# EAGLE design pmon_uno (EAGLE 6.5.0)
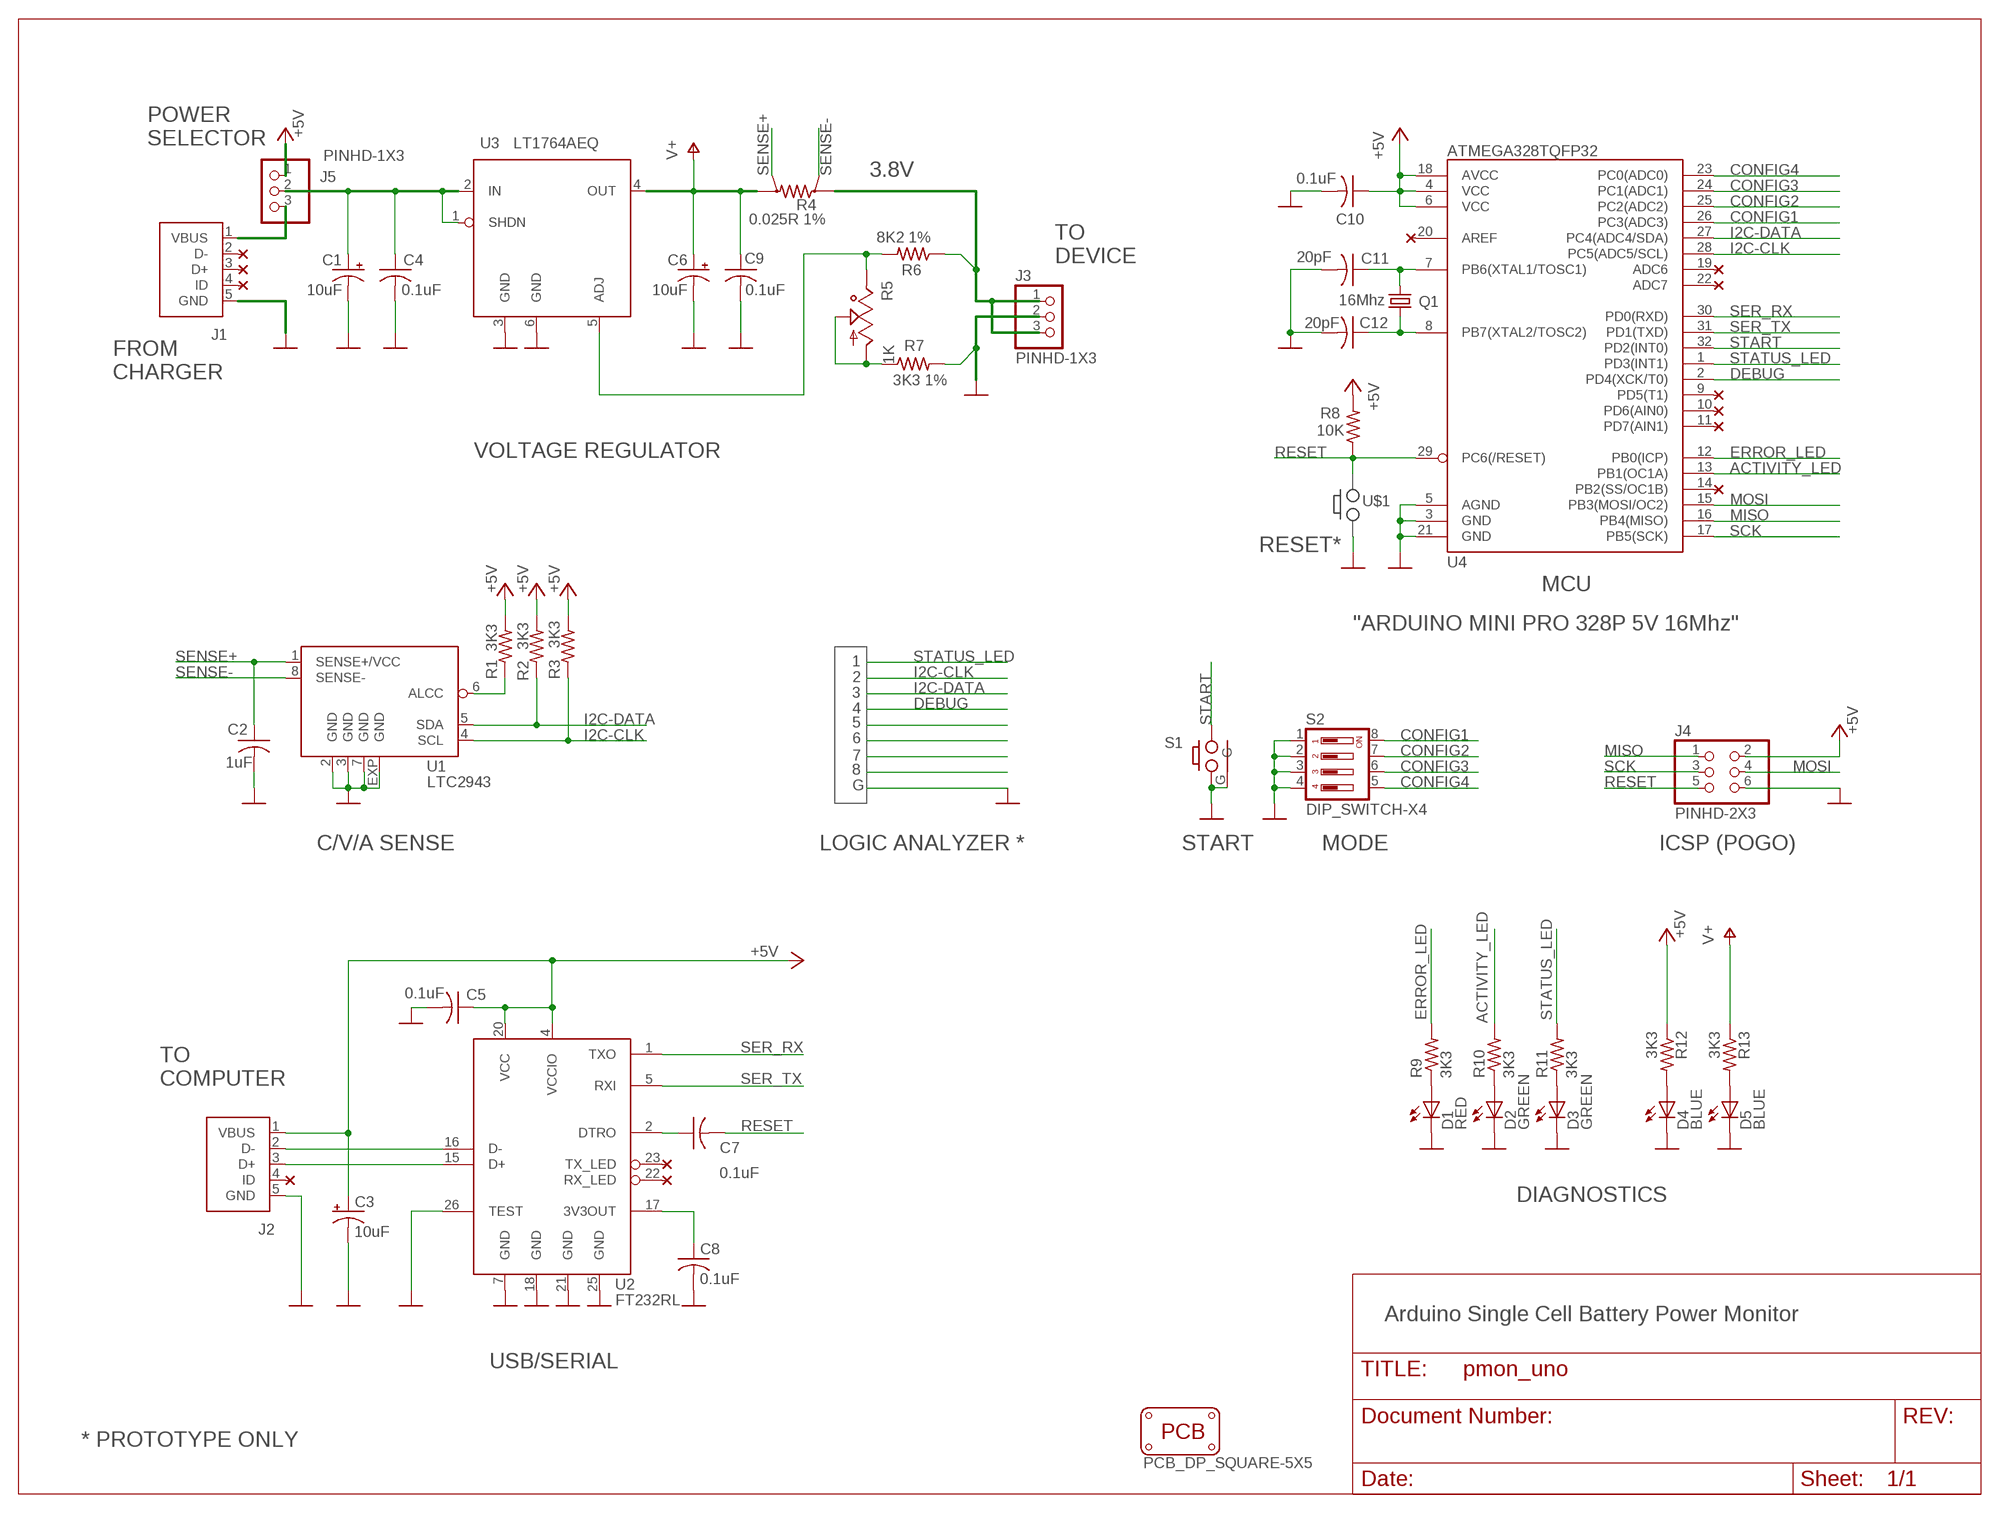
[diagram p0: schematic, sheet 1]

## Parts
C1  10uF  CPOL-USA/3216-18R  [A/3216-18R]
C2  1uF  CAP-C0603  [C0603]
C3  10uF  CPOL-USA/3216-18R  [A/3216-18R]
C4  0.1uF  CAP-C0603  [C0603]
C5  0.1uF  CAP-C0603  [C0603]
C6  10uF  CPOL-USA/3216-18R  [A/3216-18R]
C7  0.1uF  CAP-C0603  [C0603]
C8  0.1uF  CAP-C0603  [C0603]
C9  0.1uF  CAP-C0603  [C0603]
C10  0.1uF  CAP-C0603  [C0603]
C11  20pF  CAP-C0603  [C0603]
C12  20pF  CAP-C0603  [C0603]
D1  RED  LED1206  [1206-LED]
D2  GREEN  LED1206  [1206-LED]
D3  GREEN  LED1206  [1206-LED]
D4  BLUE  LED1206  [1206-LED]
D5  BLUE  LED1206  [1206-LED]
J1  USB  [USB-MICRO-ZX62RD-AB-5P8]
J2  USB  [USB-MICRO-ZX62RD-AB-5P8]
J3  PINHD-1X3  [1X03]
J4  PINHD-2X3  [2X03]
J5  PINHD-1X3  [1X03]
PCB1  PCB_DP_SQUARE-5X5  [DP5050_V1]
Q1  16Mhz  CRYSTALCTS406  [CRYSTAL-CTS406]
R1  3K3  RES-R0603  [R0603]
R2  3K3  RES-R0603  [R0603]
R3  3K3  RES-R0603  [R0603]
R4  0.025R 1%  RES-SHUNT-6432  [KELVIN-6432]
R5  1K  TRIM_US-SM-42/43A  [TRIM-POT_SM-42/43A]
R6  8K2 1%  RES-R0603  [R0603]
R7  3K3 1%  RES-R0603  [R0603]
R8  10K  RES-R0603  [R0603]
R9  3K3  RES-R0603  [R0603]
R10  3K3  RES-R0603  [R0603]
R11  3K3  RES-R0603  [R0603]
R12  3K3  RES-R0603  [R0603]
R13  3K3  RES-R0603  [R0603]
S1  PUSH_BUTTON_SHIELDED  [TLE1105]
S2  DIP_SWITCH-X4  [DIP-SWITCH-X4]
U1  LTC2943  [DFN8-3X3]
U2  FT232RL  [SSOP28DB]
U3  LT1764AEQ  LTE1764  [TO263-5]
U4  ATMEGA328TQFP32  [TQFP32-08]

## Nets
+5V: C3.+ C5.1 C10.1 J2.1(VBUS) J4.2 J5.1 R1.2 R2.2 R3.2 R8.2 R12.1 U2.4(VCCIO) U2.20(VCC) U4.4(VCC) U4.6(VCC) U4.18(AVCC)
ACTIVITY_LED: R10.2 U4.13(PB1(OC1A))
CONFIG1: S2.8 U4.26(PC3(ADC3))
CONFIG2: S2.7 U4.25(PC2(ADC2))
CONFIG3: S2.6 U4.24(PC1(ADC1))
CONFIG4: S2.5 U4.23(PC0(ADC0))
DEBUG: U4.2(PD4(XCK/T0))
ERROR_LED: R9.2 U4.12(PB0(ICP))
GND: C1.- C2.2 C3.- C4.2 C5.2 C6.- C8.2 C9.2 C10.2 C11.2 C12.2 D1.C D2.C D3.C D4.C D5.C J1.5(GND) J2.5(GND) J3.2 J4.6 R7.2 S1.A S1.G S2.1 S2.2 S2.3 S2.4 U1.2(GND) U1.3(GND) U1.7(GND) U1.EXP(GND) U2.7(GND) U2.18(GND) U2.21(GND) U2.25(GND) U2.26(TEST) U3.3(GND) U3.6(GND) U4.3(GND) U4.5(AGND) U4.21(GND)
I2C-CLK: R3.1 U1.4(SCL) U4.28(PC5(ADC5/SCL))
I2C-DATA: R2.1 U1.5(SDA) U4.27(PC4(ADC4/SDA))
MISO: J4.1 U4.16(PB4(MISO))
MOSI: J4.4 U4.15(PB3(MOSI/OC2))
N$1: R1.1 U1.6(ALCC)
N$2: C11.1 Q1.1 U4.7(PB6(XTAL1/TOSC1))
N$3: D2.A R10.1
N$4: D1.A R9.1
N$5: J1.1(VBUS) J5.3
N$7: C12.1 Q1.3 U4.8(PB7(XTAL2/TOSC2))
N$9: C1.+ C4.1 J5.2 U3.1(SHDN) U3.2(IN)
N$10: J2.3(D+) U2.15(D+)
N$11: C7.1 U2.2(DTRO)
N$14: D5.A R13.2
N$15: J2.2(D-) U2.16(D-)
N$16: C8.1 U2.17(3V3OUT)
N$17: D4.A R12.2
N$18: R5.1 R5.2 R7.1
N$19: R5.3 R6.2 U3.5(ADJ)
N$20: D3.A R11.1
N$22: J3.1 J3.3 R4.I1 R6.1
RESET: C7.2 J4.5 R8.1 U4.29(PC6(/RESET))
SCK: J4.3 U4.17(PB5(SCK))
SENSE+: C2.1 R4.V2 U1.1(SENSE+/VCC)
SENSE-: R4.V1 U1.8(SENSE-)
SER_RX: U2.1(TXO) U4.30(PD0(RXD))
SER_TX: U2.5(RXI) U4.31(PD1(TXD))
START: S1.B U4.32(PD2(INT0))
STATUS_LED: R11.2 U4.1(PD3(INT1))
V+: C6.+ C9.1 R4.I2 R13.1 U3.4(OUT)
Unconnected: J1.2(D-) J1.3(D+) J1.4(ID) J2.4(ID) U2.22(RX_LED) U2.23(TX_LED) U4.9(PD5(T1)) U4.10(PD6(AIN0)) U4.11(PD7(AIN1)) U4.14(PB2(SS/OC1B)) U4.19(ADC6) U4.20(AREF) U4.22(ADC7)

## Notes on the sheet
- POWER
  SELECTOR
- 3.8V
- TO
  DEVICE
- FROM
  CHARGER
- VOLTAGE REGULATOR
- RESET*
- MCU
- "ARDUINO MINI PRO 328P 5V 16Mhz"
- 1
- 2
- 3
- 4
- 5
- 6
- 7
- 8
- G
- C/V/A SENSE | LOGIC ANALYZER * | START | MODE | ICSP (POGO)
- TO
  COMPUTER
- DIAGNOSTICS
- Arduino Single Cell Battery Power Monitor
- USB/SERIAL
- * PROTOTYPE ONLY

## Library data of the parts
C1 C3 C6 = pmon_uno:CPOL-US
C2 C4 C5 C7-C12 = pmon_uno:CAP-: CAPACITOR, American symbol
D1-D5 = pmon_uno:LED
J1 J2 = pmon_uno:USB
J3 J5 = pmon_uno:PINHD-1X3: PIN HEADER
J4 = pmon_uno:PINHD-2X3
PCB1 = pmon_uno:PCB_DP_SQUARE: Dangerous Prototypes Standard Square PCB sizes
Q1 = pmon_uno:CRYSTAL: CRYSTAL; OC_FARNELL: unknown; OC_NEWARK: unknown
R1-R3 R6-R13 = pmon_uno:RES-: RESISTOR, American symbol
R4 = pmon_uno:RES-SHUNT-: SMD SHUNT RESISTOR
R5 = pmon_uno:TRIM_US-: POTENTIOMETER
S1 = pmon_uno:PUSH_BUTTON_SHIELDED
S2 = pmon_uno:DIP_SWITCH-X4: Surface Mount DIP Switch Series 219 SMT CTS Electronic Components Sourc: www.ctscorp.com
U1 = pmon_uno:LTC2943
U2 = pmon_uno:FT232RL
U3 = pmon_uno:LTE1764
U4 = pmon_uno:ATMEGA328

## Net classes
1 power: width 0.254 mm

## Board
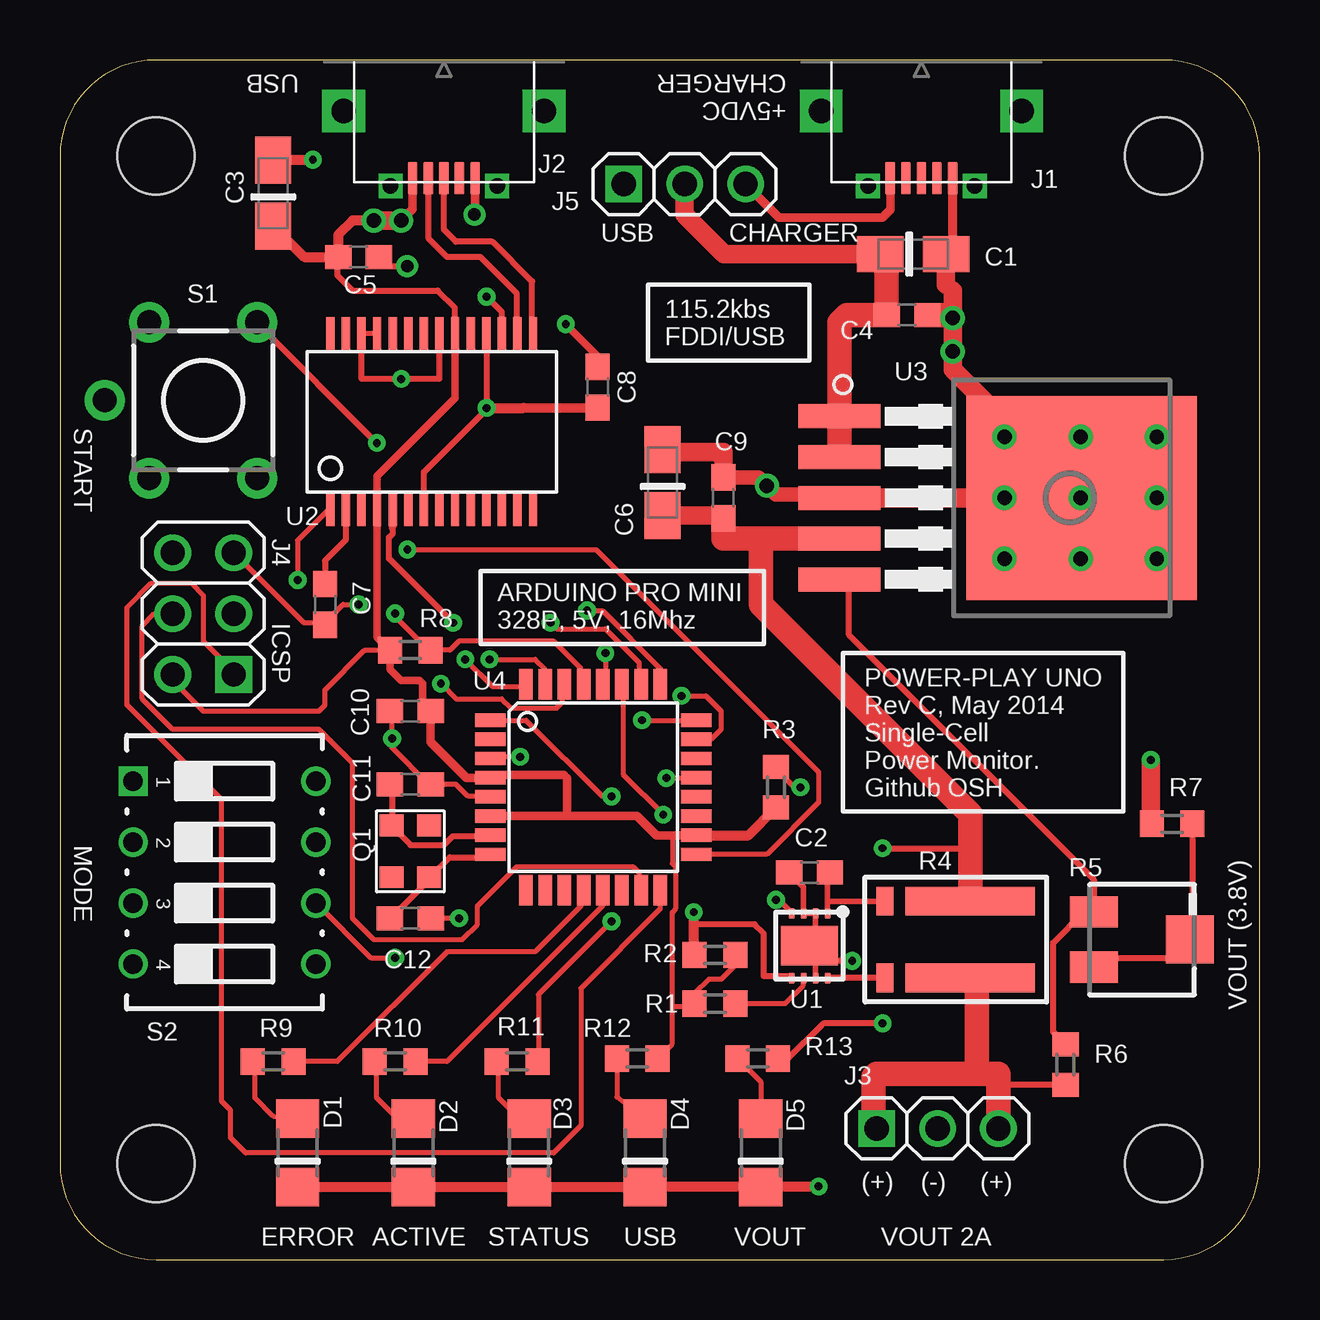
[diagram p1: board, top side]
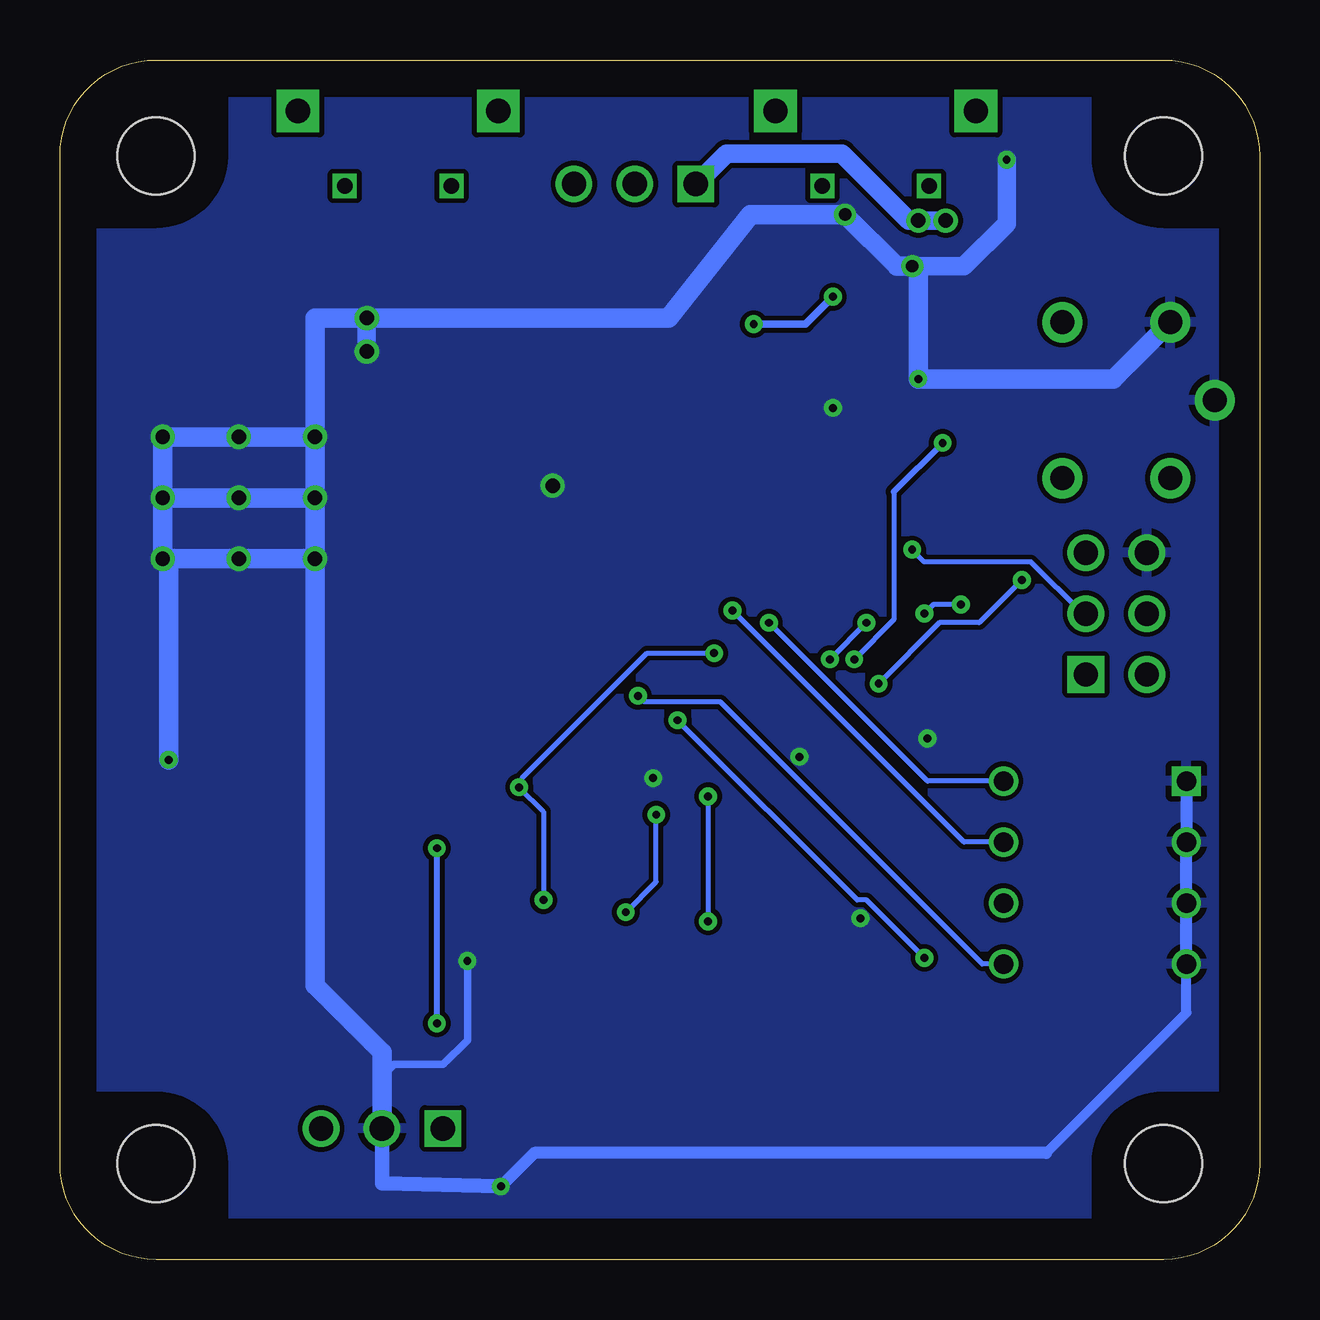
[diagram p2: board, bottom side, seen from below]

Size 50 x 50 mm. Coordinates in mm from the lower left corner, seen from the top.
Copper layers (1*16): Top 0.035mm / dielectric 1mm / bottom 0.035mm
Design rules "default *": minimum track width 8mil, minimum drill 13mil, track to track 8mil, track to pad 8mil, pad to pad 8mil, via to via 8mil, smd to smd 0mil, copper to edge 20mil, drill to drill 8mil, minimum pad ring 7mil, minimum via ring 8mil, stop-mask expansion 4mil, vias tented up to drill 30mil, thermal gap 10mil

### Footprints (pad centres in the part's own frame; a part is rotated, then mirrored left to right if it is on the bottom)
A/3216-18R = smd 1.95 x 1.5: + 1.375,0; - -1.375,0
C0603 = smd 1.1 x 1: 1 -0.85,0; 2 0.85,0
1206-LED = smd 1.6 x 1.803: A -1.422,0; C 1.422,0
USB-MICRO-ZX62RD-AB-5P8 = smd 0.4 x 1.35: 1 1.3,5.425; 2 0.65,5.425; 3 0,5.425; 4 -0.65,5.425; 5 -1.3,5.425 | drill 1.016 pad 1.778 square: A -4.175,2.625; D 4.175,2.625 | drill 0.65 pad 0.914 square: B -2.225,5.75; C 2.225,5.75
1X03 = drill 1.016 square: 1 -2.54,0 | drill 1.016: 2 0,0; 3 2.54,0
2X03 = drill 1.016 square: 1 -2.54,-1.27 | drill 1.016: 2 -2.54,1.27; 3 0,-1.27; 4 0,1.27; 5 2.54,-1.27; 6 2.54,1.27
DP5050_V1 = hole 3.2: 4,4; 46,4; 46,46; 4,46
CRYSTAL-CTS406 = smd 0.9 x 1: 1 -1.075,-0.775; 2 1.075,-0.775; 3 1.075,0.775; 4 -1.075,0.775
R0603 = smd 1 x 1.1: 1 -0.85,0; 2 0.85,0
KELVIN-6432 = smd 1.2 x 5.4: I1 -1.6,2.7; I2 1.6,2.7 | smd 1.2 x 0.7: V1 -1.6,6.25; V2 1.6,6.25
TRIM-POT_SM-42/43A = smd 2 x 1.3: 1 2,1.15; 3 2,-1.15 | smd 2 x 2: 2 -2,0
TLE1105 = drill 1 pad 1.676: A -2.25,3.25; AX -2.25,-3.25; B 2.25,3.25; BX 2.25,-3.25; G -4.1,0
DIP-SWITCH-X4 = drill 0.813 square: 1 0,0 | drill 0.813: 2 2.54,0; 3 5.08,0; 4 7.62,0; 5 7.62,7.62; 6 5.08,7.62; 7 2.54,7.62; 8 0,7.62
DFN8-3X3 = smd 0.25 x 0.45: 1 -0.75,-1.35; 2 -0.25,-1.35; 3 0.25,-1.35; 4 0.75,-1.35; 5 0.75,1.35; 6 0.25,1.35; 7 -0.25,1.35; 8 -0.75,1.35 | smd 2.38 x 1.65: EXP 0,0
SSOP28DB = smd 0.348 x 1.397: 1 -4.225,-3.656; 2 -3.575,-3.656; 3 -2.925,-3.656; 4 -2.275,-3.656; 5 -1.625,-3.656; 6 -0.975,-3.656; 7 -0.325,-3.656; 8 0.325,-3.656; 9 0.975,-3.656; 10 1.625,-3.656; 11 2.275,-3.656; 12 2.925,-3.656; 13 3.575,-3.656; 14 4.225,-3.656; 15 4.225,3.656; 16 3.575,3.656; 17 2.925,3.656; 18 2.275,3.656; 19 1.625,3.656; 20 0.975,3.656; 21 0.325,3.656; 22 -0.325,3.656; 23 -0.975,3.656; 24 -1.625,3.656; 25 -2.275,3.656; 26 -2.925,3.656; 27 -3.575,3.656; 28 -4.225,3.656
TO263-5 = smd 1 x 3.4: 1 -3.4,-6.6; 2 -1.7,-6.6; 3 0,-6.6; 4 1.7,-6.6; 5 3.4,-6.6 | smd 8.5 x 9.6: 6 0,3.5
TQFP32-08 = smd 1.27 x 0.559: 1 -4.293,2.8; 2 -4.293,2; 3 -4.293,1.2; 4 -4.293,0.4; 5 -4.293,-0.4; 6 -4.293,-1.2; 7 -4.293,-2; 8 -4.293,-2.8; 17 4.293,-2.8; 18 4.293,-2; 19 4.293,-1.2; 20 4.293,-0.4; 21 4.293,0.4; 22 4.293,1.2; 23 4.293,2; 24 4.293,2.8 | smd 0.559 x 1.27: 9 -2.8,-4.293; 10 -2,-4.293; 11 -1.2,-4.293; 12 -0.4,-4.293; 13 0.4,-4.293; 14 1.2,-4.293; 15 2,-4.293; 16 2.8,-4.293; 25 2.8,4.293; 26 2,4.293; 27 1.2,4.293; 28 0.4,4.293; 29 -0.4,4.293; 30 -1.2,4.293; 31 -2,4.293; 32 -2.8,4.293

### Placement (x,y rotation side)
C1  35.56,41.91 180 top
C2  31.24,16.13 180 top
C3  8.89,44.45 270 top
C4  35.31,39.37 0 top
C5  12.45,41.78 0 top
C6  25.12,32.38 270 top
C7  11.05,27.3 270 top
C8  22.42,36.36 270 top
C9  27.66,31.75 90 top
C10  14.61,22.86 180 top
C11  14.61,19.81 0 top
C12  14.61,14.22 0 top
D1  9.91,4.45 270 top
D2  14.73,4.45 270 top
D3  19.56,4.45 270 top
D4  24.38,4.45 270 top
D5  29.21,4.45 270 top
J1  35.91,50.5 180 top
J2  16,50.5 180 top
J3  36.58,5.46 0 top
J4  5.97,26.92 90 top
J5  26.04,44.83 0 top
PCB1  0,0 0 top
Q1  14.61,17.02 270 top
R1  27.3,10.67 180 top
R2  27.3,12.7 0 top
R3  29.84,19.68 270 top
R4  40.64,13.34 90 top
R5  45.09,13.34 180 top
R6  41.91,8.13 90 top
R7  46.35,18.16 180 top
R8  14.61,25.4 180 top
R9  8.89,8.26 0 top
R10  13.97,8.26 0 top
R11  19.05,8.26 0 top
R12  24.07,8.38 180 top
R13  29.08,8.38 180 top
S1  5.97,35.81 0 top
S2  3.05,19.94 270 top
U1  31.24,13.08 180 top
U2  15.49,34.92 0 top
U3  39.09,31.75 270 top
U4  22.23,19.68 0 top

### Tracks (layer width: path | path; a pad name or v marks a point on that pad's centre or on a via)
+5V  (via drill 0.6)
  Top 0.203: 26.54,10.67 R1.2 | R2.2 28.07,12.7 28.07,12.19 27.56,11.68 27.05,11.68 26.45,11.09 R1.2 | 25.53,17.68 25.53,16.51 25.65,16.38 25.65,14.61 25.53,14.48 25.53,10.54 | J4.2 4.7,24.13 5.97,22.86 10.79,22.86 11.05,23.11 11.05,23.75 12.7,25.4 R8.2 | R12.1 25.53,8.99 25.53,10.54 | R1.2 26.33,10.54 25.53,10.54
  Top 0.254: 11.68,41.7 C5.1 | U2.20 16.45,38.6 16.51,38.67 16.46,38.72 16.46,39.67 15.75,40.39 12.19,40.39 11.56,41.02 11.56,41.74 C5.1 | 18.04,20.19 U4.4 17.91,20.07 | 21.02,20.19 21.14,20.07 | C5.1 11.36,42.02
  Top 0.305: U2.20 16.47,35.9 13.22,32.65 U2.4 13.22,25.94 R8.2 13.76,24.6 14.22,24.13 14.99,24.13 15.11,24 15.11,23.2 C10.1
  Top 0.356: U4.6 21.14,18.48 | 21.14,18.48 24.06,18.48 24.86,17.68 25.53,17.68 U4.18 | 18.04,20.19 21.02,20.19 | 21.14,20.07 21.14,18.48 | 17.91,20.07 16.95,20.07 15.46,21.57 C10.1 | J2.1 14.7,43.78 14.29,43.37
  Top 0.406: v13.08,43.31 12.19,43.31 11.6,42.71 C5.1 10.18,41.78 C3.+ | U4.18 28.7,17.68 R3.2
  Top 0.762: 14.29,43.37 v14.22,43.31 v13.08,43.31
  bottom 0.762: v13.08,43.31 v14.22,43.31 14.61,43.31 17.4,46.1 22.23,46.1 J5.1
ACTIVITY_LED
  Top 0.203: R10.2 16.13,8.26 22.61,14.73 22.61,15.37 U4.13
CONFIG1  (via drill 0.33)
  Top 0.203: v20.45,26.54 20.7,26.29 22.73,26.29 24.13,24.89 24.13,24 U4.26
  bottom 0.203: v20.45,26.54 13.84,19.94 S2.8
CONFIG2  (via drill 0.33)
  Top 0.203: v21.97,27.05 22.61,27.05 25.02,24.64 25.02,24 U4.25
  bottom 0.203: v21.97,27.05 12.32,17.4 S2.7
CONFIG3  (via drill 0.33)
  Top 0.203: v24.26,22.48 26.42,22.48 U4.24 | v13.97,12.57 12.95,12.57 S2.6
  bottom 0.203: v24.26,22.48 16.76,14.99 16.38,14.99 v13.97,12.57
CONFIG4  (via drill 0.33)
  Top 0.203: v25.91,23.5 26.92,23.5 27.56,22.86 27.56,22.1 27.18,21.72 26.54,21.72 U4.23
  bottom 0.203: v25.91,23.5 25.65,23.24 22.48,23.24 11.56,12.32 S2.5
ERROR_LED
  Top 0.203: R9.2 11.56,8.26 16.13,12.83 19.81,12.83 21.72,14.73 21.72,15.37 U4.12
GND  (via drill 0.33, 0.51, 0.6)
  Top 0.203: 45.47,28.96 42.67,31.75 U3.6 43.43,33.66 | 45.47,18.16 R7.2 | 37.21,40.39 36.94,40.64 | U4.5 17.91,19.3 17.02,19.3 16.51,19.81 C11.2 15.37,19.81 13.84,21.34 v13.84,21.72 13.84,22.86 C10.2 | 26.54,20.07 U4.21 26.42,20.07 v25.27,20.07 | v16.64,14.22 C12.2 | v19.18,20.95 18.03,20.95 U4.3 | U2.25 13.08,38.61 12.7,38.61 U2.26 | 25.02,33.78 C6.- | 27.94,32.38 C9.2 | U3.3 33.53,31.75
  Top 0.229: U1.EXP 31.49,13.33 U1.2 U1.3 30.99,15.53 C2.2 | 31.5,11.81 31.5,12.83
  Top 0.254: 17.78,38.61 U2.18 v17.78,35.5 17.78,35.43 15.18,32.83 U2.7 | 25.63,33.66 C6.- | 12.57,38.61 U2.26 12.57,36.96 12.57,36.7 v14.22,36.7 15.81,36.7 U2.21 | 13.21,38.61 U2.25 | 31.5,12.45 31.5,12.83 U1.EXP | 31.5,11.81 U1.7 | 31.37,13.08 U1.EXP | v33.02,12.45 31.5,12.45 | 31.5,12.45 U1.EXP | 43.54,33.66 42.65,32.77 42.65,31.75 U3.6 | C5.2 13.68,41.4 v14.48,41.4 | 17.3,43.59 v17.27,43.56 | v10.54,45.85 10.52,45.83
  Top 0.356: J2.5 17.3,43.59
  Top 0.381: J1.5 37.2,42.55
  Top 0.406: 37.2,42.55 C1.- | D1.C D2.C D3.C D4.C D5.C 31.6,3.02 v31.62,3.05 | v17.78,35.5 19.33,35.5 C8.2 | 10.52,45.83 C3.- | U3.3 32.36,31.88
  Top 0.61: 41.53,32.77 42.65,32.77 | 32.36,31.88 29.84,31.88 v29.46,32.26 29.12,32.6 C9.2
  Top 0.762: C1.- 36.94,40.64 | C9.2 27.66,33.66 25.63,33.66 | 37.21,40.39 v37.21,39.24 37.21,37.97 | v37.21,37.85 37.21,37.08 41.53,32.77 | 45.47,18.16 v45.47,20.83
  Top 0.813: 33.53,31.75 40.39,31.75 41.4,32.77 41.53,32.77
  Top 1.016: C4.2 37.08,39.37 v37.21,39.24
  bottom 0.305: J3.2 36.58,7.62 36.07,8.13 34.04,8.13 33.02,9.14 v33.02,12.45
  bottom 0.406: 8.89,4.45 3.05,10.29 S2.4
  bottom 0.508: 8.89,4.45 30.23,4.45 v31.62,3.05 | S2.4 S2.3 S2.2 S2.1
  bottom 0.61: v31.62,3.05 36.58,3.17 J3.2
  bottom 0.762: v37.21,39.24 v37.21,37.85 | v10.54,45.85 10.54,43.18 12.32,41.4 v14.48,41.4
  bottom 0.813: v39.37,34.29 39.37,39.24 v37.21,39.24 24.64,39.24 21.21,43.56 v17.27,43.56 15.11,41.4 v14.48,41.4 14.22,41.15 v14.22,36.7 6.1,36.7 3.68,39.12 | v39.37,34.29 v42.55,34.29 v45.72,34.29 v45.72,31.75 | v45.72,31.75 v45.72,29.21 | v45.72,29.21 v42.55,29.21 v39.37,29.21 | v39.37,29.21 v39.37,31.75 | v39.37,31.75 v39.37,34.29 | v39.37,31.75 v42.55,31.75 v45.72,31.75 | v45.72,29.21 45.47,29.21 v45.47,20.83 | v39.37,29.21 39.37,11.43 36.58,8.64 J3.2
  pour bottom: 4.19,1.91 45.97,1.91 arc90 48.26,4.19 48.26,45.97 arc90 45.97,48.26 4.19,48.26 arc90 1.91,45.97 1.91,4.19 arc90
I2C-CLK  (via drill 0.33)
  Top 0.203: v29.84,14.99 29.97,14.99 30.48,14.48 U1.4 | v30.86,19.68 30.61,19.68 29.84,20.45 R3.1 | v22.73,25.27 22.73,24 U4.28
  Top 0.254: 22.61,23.88 U4.28
  bottom 0.203: v29.84,14.99 29.84,18.67 v30.86,19.68 30.73,19.68 30.73,20.07 25.53,25.27 v22.73,25.27
I2C-DATA  (via drill 0.33)
  Top 0.203: 30.48,11.81 U1.5 | 26.54,12.7 R2.1 | v25.15,18.54 23.5,20.19 23.5,23.88 U4.27
  Top 0.254: 30.48,11.81 29.34,11.81 29.34,13.59 28.96,13.97 26.42,13.97
  Top 0.406: v26.42,14.48 26.42,13.97 26.42,12.74 R2.1
  bottom 0.203: v25.15,18.54 25.15,15.75 v26.42,14.48
MISO
  Top 0.203: U4.16 25.02,15.37 25.02,14.61 21.72,11.3 21.72,5.59 20.57,4.45 7.75,4.45 7.11,5.08 7.11,6.22 6.73,6.6 6.73,19.18 2.79,23.11 2.79,27.18 3.81,28.19 5.46,28.19 5.97,27.69 5.97,25.78 7.24,24.51 J4.1
MOSI
  Top 0.203: U4.15 24.13,15.49 24.13,16.13 23.88,16.38 19.05,16.38 17.4,14.73 17.4,13.97 16.76,13.34 13.08,13.34 12.19,14.22 12.19,20.7 10.79,22.1 4.7,22.1 3.43,23.37 3.43,26.42 3.94,26.92 J4.4
N$1
  Top 0.203: R1.1 30.23,10.67 30.99,11.43 30.99,11.68 U1.6
N$2
  Top 0.254: C11.1 13.84,19.68 13.84,18.16 Q1.1 13.84,18.03 14.61,17.27 16,17.27 16.38,17.65 17.91,17.65 U4.7
N$3
  Top 0.203: R10.1 13.21,8.26 13.21,6.73 13.97,5.97 D2.A
N$4
  Top 0.203: R9.1 8.13,8.26 8.13,6.73 8.89,5.97 D1.A
N$5
  Top 0.356: J1.1 34.62,43.76 34.29,43.43 29.97,43.43 J5.3
N$7
  Top 0.203: C12.1 13.84,14.22 14.22,14.61 14.19,14.64
  Top 0.254: U4.8 17.91,16.76 16.26,16.76 15.49,16 Q1.3 15.38,15.82 14.19,14.64 14.16,14.61
N$9
  Top 0.762: J5.2 26.04,43.56 27.69,41.91 C1.+
  Top 1.016: U3.2 U3.1 32.49,39.06 32.8,39.37 C4.1 34.46,41.64 C1.+
N$10
  Top 0.254: U2.15 19.68,38.62 19.68,40.77 18.03,42.42 16.51,42.42 16,42.93 J2.3
N$11
  Top 0.203: 11.94,31.24 U2.2
  Top 0.254: U2.2 11.91,30 11.05,29.13 C7.1
N$14
  Top 0.203: R13.2 29.21,7.41 D5.A
N$15
  Top 0.254: U2.16 19.05,38.6 19.05,40.26 17.53,41.78 16.13,41.78 15.37,42.55 15.37,45.06 J2.2
N$16  (via drill 0.33)
  Top 0.254: U2.17 18.42,39.49 v17.78,40.13
  Top 0.305: C8.1 22.42,37.66 v21.08,38.99
  bottom 0.305: v21.08,38.99 18.92,38.99 v17.78,40.13
N$17
  Top 0.203: R12.2 23.22,6.78 D4.A
N$18
  Top 0.254: R7.1 47.2,13.46 R5.2 47.09,12.92 46.74,12.57 43.47,12.57 R5.1
N$19
  Top 0.254: 34.01,28.57 33.79,28.35 33.02,28.35 | 33.02,28.35 U3.5 | 33.02,28.35 32.89,28.22 32.89,26.04 43.09,15.84 R5.3 42.68,14.48 41.4,13.21 41.4,9.49 R6.2
  Top 0.406: U3.5 32.74,28.35
N$20
  Top 0.203: R11.1 18.29,8.26 18.29,6.73 19.05,5.97 D3.A
N$22
  Top 0.254: R6.1 39.12,7.28 39.12,7.75
  Top 0.762: 38.1,11.57 R4.I1
  Top 1.016: J3.1 33.91,5.59 33.91,7.62 34.04,7.75 38.23,7.75 | 38.23,7.75 39.12,7.75 J3.3 | 38.1,11.57 38.23,11.57 38.23,7.75
RESET  (via drill 0.33)
  Top 0.203: U4.29 21.72,24 21.72,24.64 20.57,25.78 16.64,25.78 16.26,25.4 R8.1 15.37,25.4 13.97,26.8 v13.97,26.92 | 11.05,26.54 10.16,26.54 J4.5 | v12.45,27.3 11.81,27.3 11.05,26.54 | 11.05,26.54 C7.2
  bottom 0.203: v13.97,26.92 13.59,27.3 v12.45,27.3
SCK  (via drill 0.33)
  Top 0.203: v14.48,29.59 22.35,29.59 31.62,20.32 31.62,19.05 29.46,16.89 26.54,16.89 U4.17
  bottom 0.203: v14.48,29.59 13.97,29.08 9.53,29.08 7.37,26.92 J4.3
SENSE+
  Top 0.229: U1.1 31.99,14.99 | 31.99,14.99 31.99,15.65 C2.1 | R4.V2 32.04,14.94 31.99,14.99
SENSE-
  Top 0.254: R4.V1 U1.8
SER_RX  (via drill 0.33)
  Top 0.203: 21.08,23.88 U4.30 20.95,23.88 20.95,23.24 20.7,22.99 18.8,22.99 18.41,23.37 16.51,23.37 v15.88,24 | v9.91,28.32 9.91,29.97 11.18,31.24 U2.1
  Top 0.254: 20.95,24 U4.30 | 11.3,31.37 U2.1
  bottom 0.203: v15.88,24 13.34,26.54 11.68,26.54 v9.91,28.32
SER_TX  (via drill 0.33)
  Top 0.203: 20.19,23.88 U4.31 20.19,24 20.19,24.64 19.81,25.02 v17.91,25.02 | 13.84,31.24 U2.5
  Top 0.254: v16.38,26.54 13.72,29.21 13.72,30.1 13.88,30.26 13.88,30.52 | 13.88,31.27 13.88,30.52 | 13.88,30.52 13.84,30.48 13.84,31.24 U2.5
  bottom 0.203: v16.38,26.54 v17.91,25.02
START  (via drill 0.33)
  Top 0.203: v16.89,25.02 18.03,23.88 19.18,23.88 U4.32
  Top 0.254: 19.3,23.88 U4.32 | v13.21,34.04 8.22,39.02 S1.B
  bottom 0.203: v16.89,25.02 15.24,26.67 15.24,32
  bottom 0.254: v13.21,34.04 15.24,32
STATUS_LED  (via drill 0.33)
  Top 0.203: v22.99,14.1 19.94,11.05 19.94,8.26 R11.2 | v22.99,19.3 22.61,19.3 19.43,22.48 18.03,22.48 U4.1
  bottom 0.203: v22.99,19.3 v22.99,14.1
V+  (via drill 0.33)
  Top 0.254: v34.29,17.14 37.94,17.14 | v34.29,9.84 31.81,9.84 30.23,8.26 R13.1
  Top 0.406: 27.55,31.01 C9.1
  Top 0.762: 27.55,31.01 C6.+ | R4.I2 36.2,14.94
  Top 1.016: U3.4 29.21,30.05 | 29.21,30.05 27.66,30.05 C9.1 | R4.I2 37.94,17.14 37.94,18.57 29.21,27.3 29.21,30.05
  bottom 0.254: v34.29,9.84 v34.29,17.14

### Text on the board
tPlace: USB | +5VDC / CHARGER | USB | CHARGER | 115.2kbs / FDDI/USB | START | ICSP | ARDUINO PRO MINI / 328P, 5V, 16Mhz | POWER-PLAY UNO / Rev C, May 2014 / Single-Cell / Power Monitor. / Github OSH | MODE | VOUT (3.8V) | (+) | (-) | (+) | ERROR | ACTIVE | STATUS | USB | VOUT | VOUT 2A
bStop: POWER-PLAY UNO - REV C